# EAGLE design x-BIMU Bluetooth (EAGLE 6.5.0)
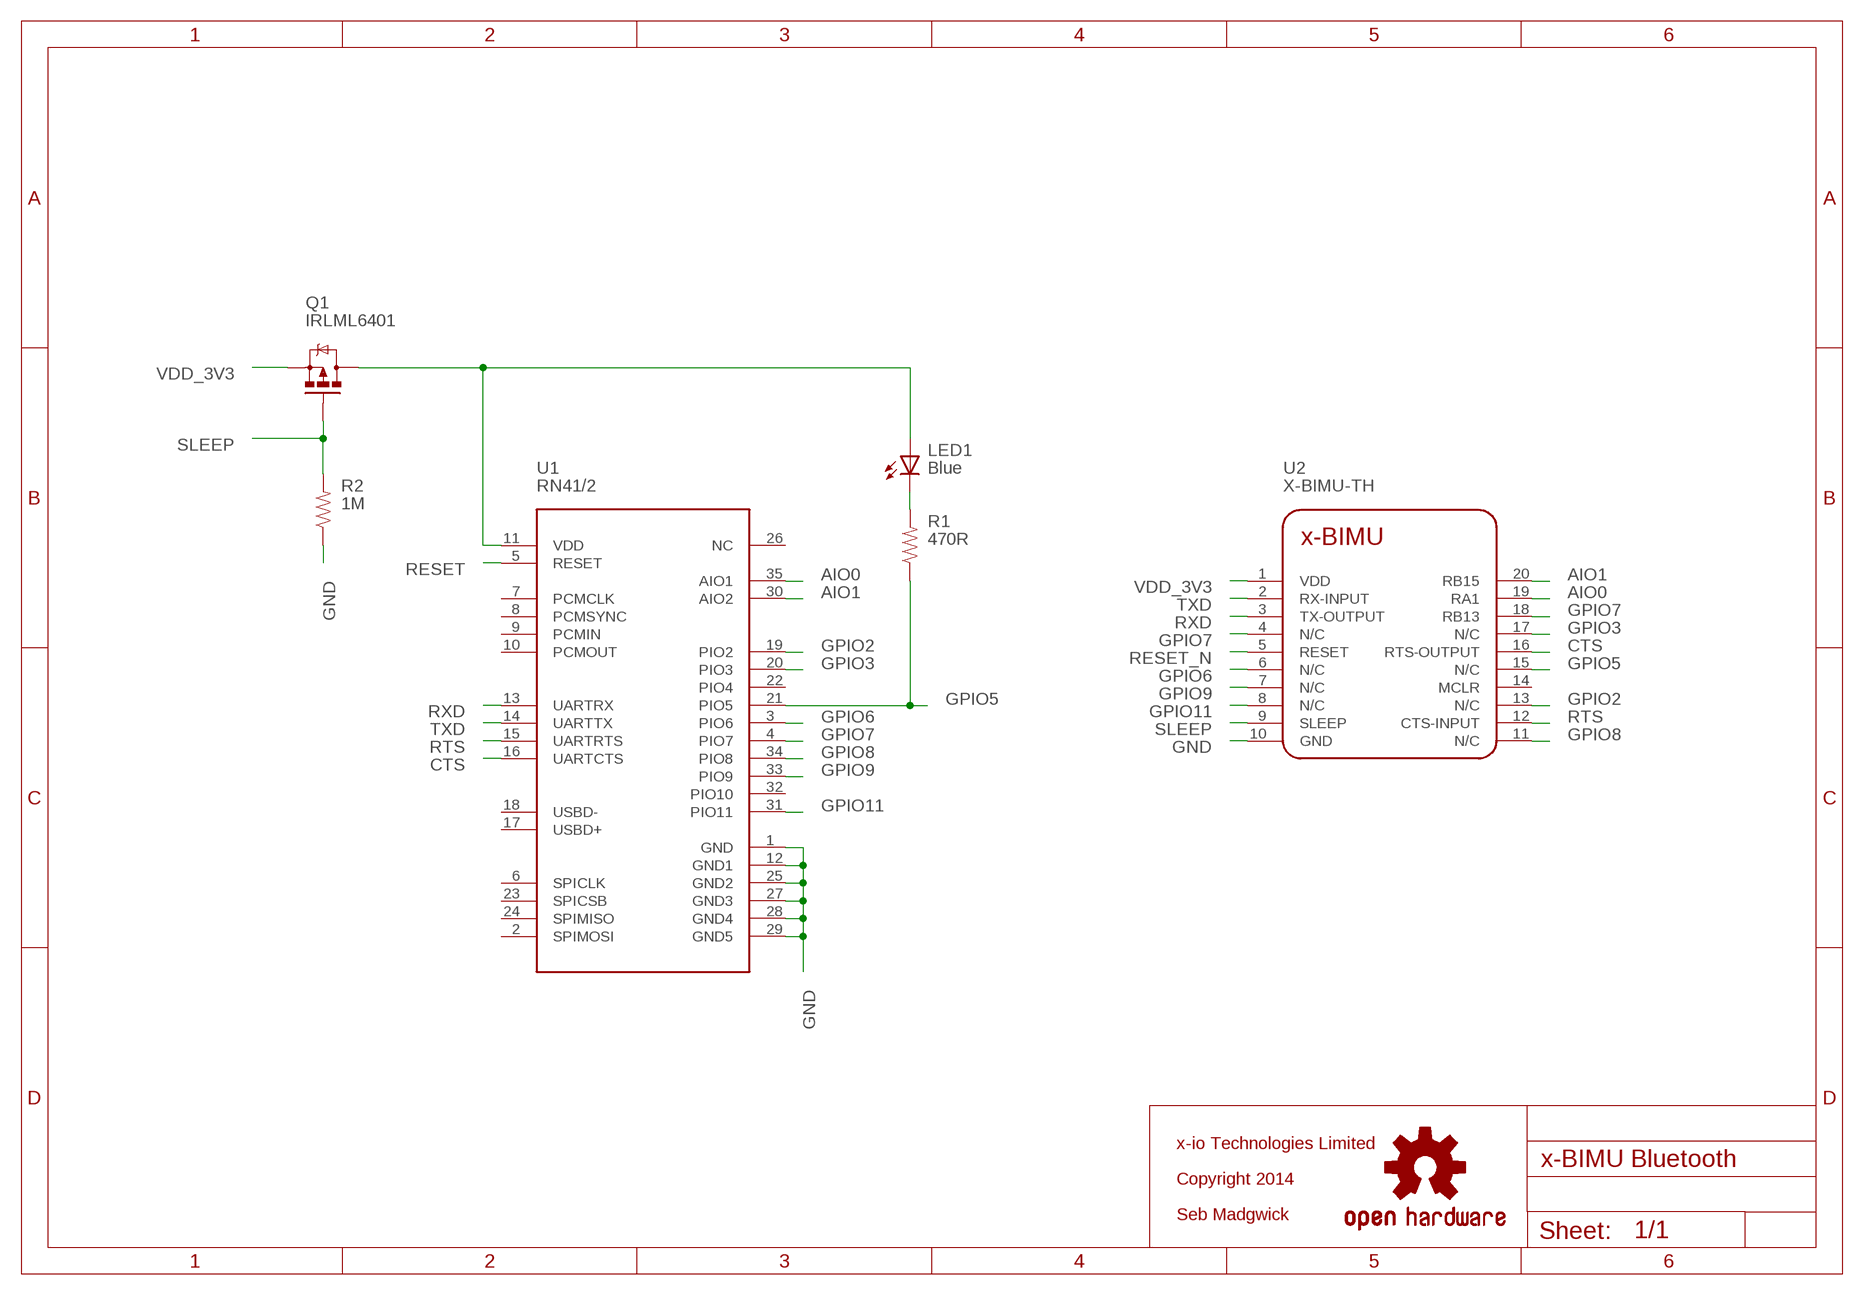
[diagram p0: schematic, sheet 1]

## Parts
LED1  Blue  LED0603  [LED-0603]
Q1  IRLML6401  MOSFET-PCHANNEL  [SOT23]
R1  470R  RESISTOR0402-RES  [0402-RES]
R2  1M  RESISTOR0402-RES  [0402-RES]
U1  RN41/2  BLUETOOTH-RN41"  [RN41]
U2  X-BIMU-TH  [X-BIMU_TH]
U$3  OSHW-LOGOS  [OSHW-LOGO-S]

## Nets
AIO0: U1.35(AIO1) U2.19(RA1)
AIO1: U1.30(AIO2) U2.20(RB15)
CTS: U1.16(UARTCTS) U2.16(RTS-OUTPUT)
GND: R2.1 U1.1(GND) U1.12(GND1) U1.25(GND2) U1.27(GND3) U1.28(GND4) U1.29(GND5) U2.10(GND)
GPIO2: U1.19(PIO2) U2.13(N/C)
GPIO3: U1.20(PIO3) U2.17(N/C)
GPIO5: R1.1 U1.21(PIO5) U2.15(N/C)
GPIO6: U1.3(PIO6) U2.6(N/C)
GPIO7: U1.4(PIO7) U2.4(N/C) U2.18(RB13)
GPIO8: U1.34(PIO8) U2.11(N/C)
GPIO9: U1.33(PIO9) U2.7(N/C)
GPIO11: U1.31(PIO11) U2.8(N/C)
N$3: LED1.A Q1.3(D) U1.11(VDD)
N$8: LED1.C R1.2
RESET: U1.5(RESET)
RESET_N: U2.5(RESET)
RTS: U1.15(UARTRTS) U2.12(CTS-INPUT)
RXD: U1.13(UARTRX) U2.3(TX-OUTPUT)
SLEEP: Q1.1(G) R2.2 U2.9(SLEEP)
TXD: U1.14(UARTTX) U2.2(RX-INPUT)
VDD_3V3: Q1.2(S) U2.1(VDD)
Unconnected: U1.2(SPIMOSI) U1.6(SPICLK) U1.7(PCMCLK) U1.8(PCMSYNC) U1.9(PCMIN) U1.10(PCMOUT) U1.17(USBD+) U1.18(USBD-) U1.22(PIO4) U1.23(SPICSB) U1.24(SPIMISO) U1.26(NC) U1.32(PIO10) U2.14(MCLR)

## Notes on the sheet
- x-io Technologies Limited
- Copyright 2014
- Seb Madgwick

## Library data of the parts
LED1 = SparkFun:LED: LEDs Standard schematic elements and footprints for 5mm, 3mm, 1206, and 0603 sized LEDs. 5mm - Spark Fun Electronics SKU : COM-00529 (and others)
Q1 = SparkFun:MOSFET-PCHANNEL
R1 R2 = SparkFun:RESISTOR: Resistor Basic schematic elements and footprints for 0603, 1206, and PTH 1/10th watt (small) resistors.
U1 = SparkFun:BLUETOOTH-RN41
U2 = x-io-EAGLE-Library:X-BIMU: x-BIMU <http://www.x-io.co.uk/products/x-bimu/> foot print for SMD or through-hole headers.
U$3 = SparkFun_08_2011:OSHW-LOGO: Open Source Hardware Logo This logo indicates the piece of hardware it is found on incorporates a OSHW license and/or adheres to the definition of open source hardware found here: http://freedomdefined.org/OSHW

## Board
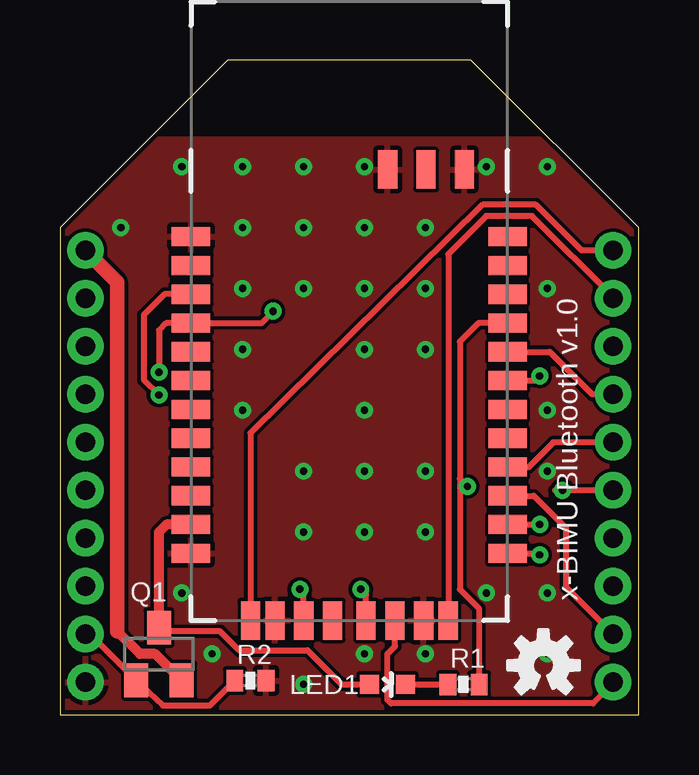
[diagram p1: board, top side]
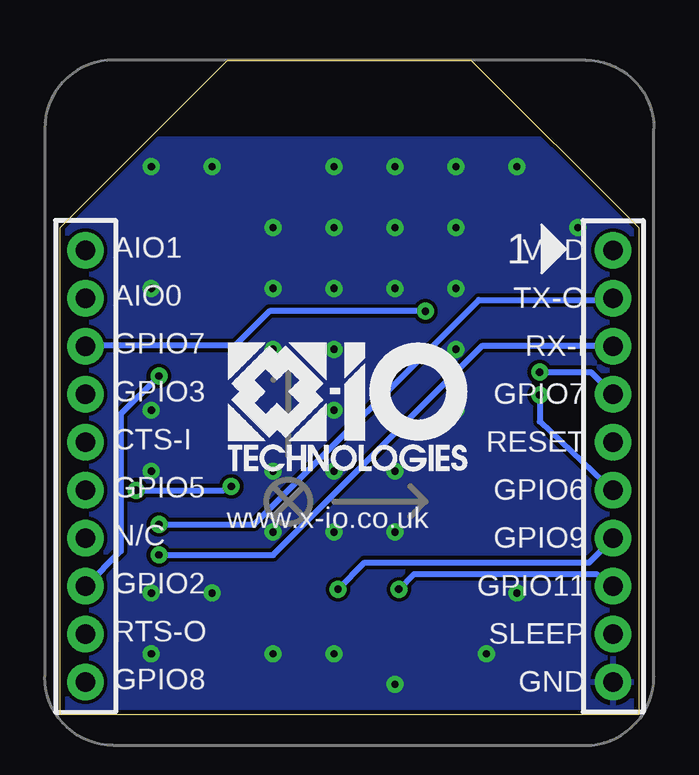
[diagram p2: board, bottom side, seen from below]

Size 24.13 x 27.3 mm. Coordinates in mm from the lower left corner, seen from the top.
Outline: 0,0 24.13,0 24.13,20.32 17.14,27.3 6.99,27.3 0,20.32 0,0
Copper layers (1*16): Top 0.035mm / dielectric 1.5mm / Bottom 0.035mm
Design rules "default *": minimum track width 0.15mm, minimum drill 0.3mm, track to track 0.15mm, track to pad 0.15mm, pad to pad 0.15mm, via to via 0.15mm, smd to smd 0.15mm, copper to edge 0.2mm, drill to drill 0.15mm, minimum pad ring 10mil, minimum via ring 8mil, stop-mask expansion 4mil, vias tented up to drill 1mm, thermal gap 0.195mm
tRestrict: area 0,24.1 to 24.1,27.3
bRestrict: area 0,24.1 to 24.1,27.3

### Footprints (pad centres in the part's own frame; a part is rotated, then mirrored left to right if it is on the bottom)
LED-0603 = smd 0.8 x 0.8: A 0,-0.75; C 0,0.75
SOT23 = smd 1 x 1.4: 1 -0.95,-1.1; 2 0.95,-1.1; 3 0,1.1
0402-RES = smd 0.7 x 0.9: 1 -0.65,0; 2 0.65,0
RN41 = smd 0.8 x 1.6: 1 -6.6,-6.6; 2 -5.4,-6.6; 3 -4.2,-6.6; 4 -3,-6.6; 5 -1.8,-6.6; 6 -0.6,-6.6; 7 0.6,-6.6; 8 1.8,-6.6; 9 3,-6.6; 10 4.2,-6.6; 11 5.4,-6.6; 12 6.6,-6.6; 13 6.6,6.6; 14 5.4,6.6; 15 4.2,6.6; 16 3,6.6; 17 1.8,6.6; 18 0.6,6.6; 19 -0.6,6.6; 20 -1.8,6.6; 21 -3,6.6; 22 -4.2,6.6; 23 -5.4,6.6; 24 -6.6,6.6 | smd 1.6 x 0.8: 25 -9.4,4.8; 26 -9.4,3.2; 27 -9.4,1.6; 28 9.4,3.1; 29 9.4,-3.1; 30 9.4,-4.122; 31 9.4,-1.9; 32 9.4,-0.7; 33 9.4,0.7; 34 9.4,1.9; 35 9.4,4.122
X-BIMU_TH = drill 0.8 pad 1.524: 1 11,7.935; 2 11,5.935; 3 11,3.935; 4 11,1.935; 5 11,-0.065; 6 11,-2.065; 7 11,-4.065; 8 11,-6.065; 9 11,-8.065; 10 11,-10.065; 11 -11,-10.065; 12 -11,-8.065; 13 -11,-6.065; 14 -11,-4.065; 15 -11,-2.065; 16 -11,-0.065; 17 -11,1.935; 18 -11,3.935; 19 -11,5.935; 20 -11,7.935

### Placement (x,y rotation side)
LED1  13.65,1.27 270 top
Q1  4.13,2.54 0 top
R1  16.83,1.27 180 top
R2  7.94,1.43 180 top
U1  12.06,13.34 270 top
U2  12.06,11.43 0 bottom
U$1  [X-IO_TECHNOLOGIES_LOGO_10MM_BOTTOM]  17.14,10.16 0 bottom
U$2  [X-BIMU_BLUETOOTH_V1_0_BOTTOM]  0,0 0 top
U$3  20.16,2.06 0 top
U$4  [X-BIMU_BLUETOOTH_V1_0_TOP]  0,0 0 top

### Tracks (layer width: path | path; a pad name or v marks a point on that pad's centre or on a via)
AIO0
  Top 0.254: U1.35 16.19,19.21 17.78,20.8 19.68,20.8 23.07,17.42 U2.19
AIO1
  Top 0.254: U2.20 21.75,19.36 19.84,21.27 17.62,21.27 7.94,11.75 U1.30
CTS
  Top 0.254: U2.16 20.57,11.37 19.54,10.34 U1.16
GND  (via drill 0.3)
  other vias: 10.16,1.27 12.7,2.54 15.24,2.54 17.78,5.08 20.32,5.08 20.32,12.7 20.32,17.78 15.24,7.62 12.7,7.62 10.16,7.62 10.16,10.16 12.7,10.16 15.24,10.16 5.08,5.08 12.7,20.32 10.16,20.32 7.62,20.32 2.54,20.32 7.62,15.24 12.7,15.24 15.24,15.24 20.32,10.16 15.24,20.32 7.62,12.7 5.08,22.86 7.62,22.86 10.16,22.86 12.7,22.86 20.32,22.86 20.32,2.54 7.62,17.78 10.16,17.78 12.7,17.78 15.24,17.78 17.78,22.86 12.7,12.7 6.35,2.54
  pour Top: 0,0 24.13,0 24.13,20.32 17.14,27.3 6.99,27.3 0,20.32
  pour Bottom: 0,0 0,20.32 6.99,27.3 17.14,27.3 24.13,20.32 24.13,0
GPIO2  (via drill 0.3)
  Top 0.254: U1.19 19.81,13.94 v20,14.13
  Bottom 0.254: v20,14.13 21.59,12.54 21.59,6.83 U2.13
GPIO3
  Top 0.254: U2.17 22.2,13.37 20.43,15.13 U1.20
GPIO5  (via drill 0.3)
  Top 0.254: U1.21 17.45,16.34 16.67,15.56 16.67,9.84 | 16.67,9.84 16.67,5.24 17.46,4.45 17.46,1.28 R1.1 | U2.15 20.64,9.37 v20.95,9.37 | v16.99,9.53 16.67,9.84
  Bottom 0.254: v20.95,9.37 17.3,9.37 v16.99,9.53
GPIO6  (via drill 0.3)
  Top 0.254: U1.3 4.36,17.54 3.49,16.67 3.49,13.97 v4.13,13.34
  Bottom 0.254: v4.13,13.34 4.13,12.22 1.06,9.32 U2.6
GPIO7  (via drill 0.3)
  Top 0.254: v8.89,16.83 8.4,16.34 U1.4 4.43,16.34 4.13,16.03 v4.13,14.29
  Bottom 0.254: v8.89,16.83 15.4,16.83 16.83,15.4 23.03,15.4 U2.18 | v4.13,14.29 1.99,14.29 U2.4
GPIO8
  Top 0.254: U2.11 23.11,1.36 22.23,0.48 13.81,0.48 13.65,0.64 13.65,2.54 13.97,2.86 U1.34
GPIO9  (via drill 0.3)
  Top 0.254: U1.33 12.77,5.01 v12.54,5.24
  Bottom 0.254: v12.54,5.24 11.43,6.35 2.06,6.35 U2.7
GPIO11  (via drill 0.3)
  Top 0.254: U1.31 10.16,5.08 v10,5.24
  Bottom 0.254: v10,5.24 9.37,5.87 1.75,5.87 1.24,5.37 U2.8
N$3
  Top 0.254: 4.28,3.49 6.67,3.49 7.46,2.7 10.32,2.7 11.75,1.27 LED1.A
  Top 0.406: 4.28,3.49 Q1.3 4.13,7.62 4.45,7.94 4.45,7.93 U1.11
N$8
  Top 0.254: LED1.C R1.2
RTS
  Top 0.254: U1.15 19.76,9.13 21.11,7.78 21.11,5.32 U2.12
RXD  (via drill 0.3)
  Top 0.254: U1.13 19.93,6.74 v20,6.67
  Bottom 0.254: v20,6.67 15.24,6.67 6.51,15.4 1.1,15.4 U2.3
SLEEP
  Top 0.254: U2.9 1.25,3.37 Q1.1 3.18,1.43 4.29,0.4 6.26,0.4 R2.2
TXD  (via drill 0.3)
  Top 0.254: U1.14 v20,7.93 v20,7.94
  Bottom 0.254: v20,7.94 16.03,7.94 6.67,17.3 1.13,17.3 U2.2
VDD_3V3
  Top 0.406: 4.91,1.44 4.91,1.6 3.97,2.54 3.33,2.54 2.38,3.49
  Top 0.61: U2.1 2.38,18.05 2.38,3.49 | 4.91,1.44 Q1.2

### Text on the board
_tsilk: x-BIMU Bluetooth v1.0
_bsilk: VDD | AIO1 | TX-O | AIO0 | RX-I | GPIO7 | GPIO7 | GPIO3 | RESET | CTS-I | GPIO6 | GPIO5 | GPIO9 | www.x-io.co.uk | N/C | GPIO11 | GPIO2 | SLEEP | RTS-O | GND | GPIO8